# Altium schematic sheet display.SchDoc
size A3
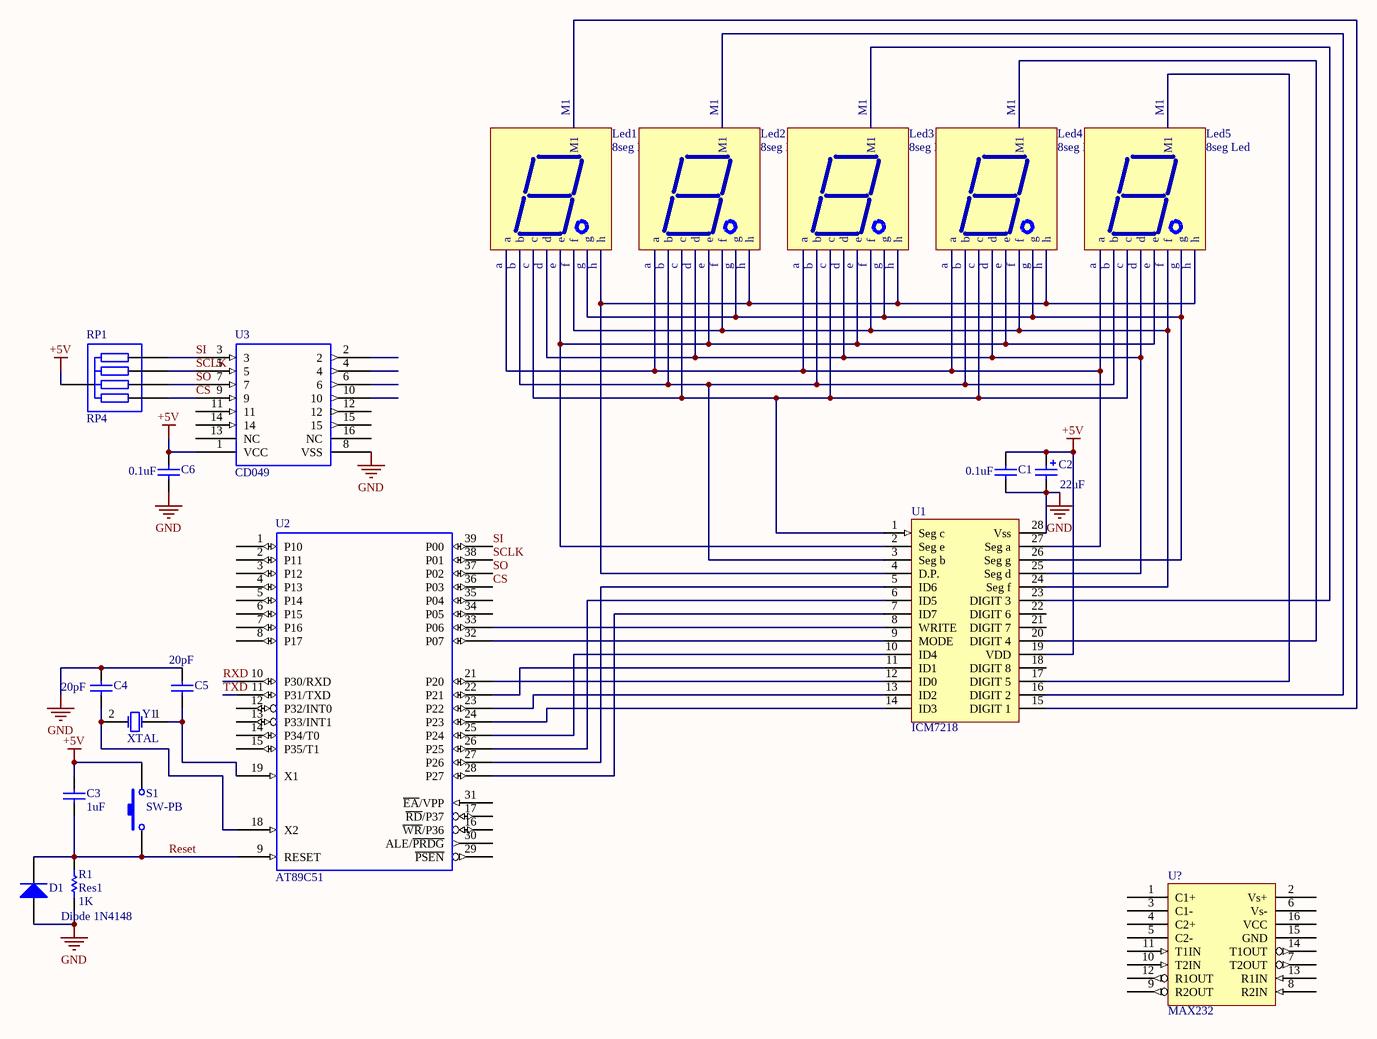
[diagram p0: display.SchDoc]

## Parts
C1  value 0.1uF  [RAD-0.3]  (hidden comment: Cap)
C2  22uF  [POLAR0.8]
C3  value 1uF  [RAD-0.3]  (hidden comment: Cap)
C4  value 20pF  [RAD-0.3]  (hidden comment: Cap)
C5  value 20pF  [RAD-0.3]  (hidden comment: Cap)
C6  value 0.1uF  [RAD-0.3]  (hidden comment: Cap)
D1  Diode 1N4148  [DIO7.1-3.9x1.9]
Led1  8seg Led
Led2  8seg Led
Led3  8seg Led
Led4  8seg Led
Led5  8seg Led
R1  Res1  value 1K  [AXIAL-0.3]
RP1  RP4  [SIP9]
S1  SW-PB  [SPST-2]
U1  ICM7218
U2  AT89C51  [DIP-40]
U3  CD049
U?  MAX232  [SOIC16]
Y1  XTAL  [BCY-W2/D3.1]

## Nets
+5V: C1.2 C2.1 C3.1 C6.2 RP1.1 S1.2 U1.19(VDD) U3.1(VCC)
GND: C1.1 C2.2 C4.1 C5.2 C6.1 D1.1(A) R1.1 U1.28(Vss) U2.20(GND) U3.8(VSS)
VCC: U2.40(VCC)
CS: RP1.5 U2.36(P03) U3.9
Reset: C3.2 D1.2(K) R1.2 S1.1 U2.9(RESET)
RXD: U2.10(P30/RXD)
SCLK: RP1.3 U2.38(P01) U3.5
SI: RP1.2 U2.39(P00) U3.3
SO: RP1.4 U2.37(P02) U3.7
TXD: U2.11(P31/TXD)
NetC4_2: C4.2 U2.18(X2) Y1.2(OSC2)
NetC5_1: C5.1 U2.19(X1) Y1.1(OSC1)
NetLed1_a: Led1.a Led2.a Led3.a Led4.a Led5.a U1.27(Seg_a)
NetLed1_b: Led1.b Led2.b Led3.b Led4.b Led5.b U1.3(Seg_b)
NetLed1_c: Led1.c Led2.c Led3.c Led4.c Led5.c U1.1(Seg_c)
NetLed1_d: Led1.d Led2.d Led3.d Led4.d Led5.d U1.25(Seg_d)
NetLed1_e: Led1.e Led2.e Led3.e Led4.e Led5.e U1.2(Seg_e)
NetLed1_f: Led1.f Led2.f Led3.f Led4.f Led5.f U1.24(Seg_f)
NetLed1_g: Led1.g Led2.g Led3.g Led4.g Led5.g U1.26(Seg_g)
NetLed1_h: Led1.h Led2.h Led3.h Led4.h Led5.h U1.4(D.P.)
NetLed1_M1: Led1.M1 U1.15(DIGIT_1)
NetLed2_M1: Led2.M1 U1.16(DIGIT_2)
NetLed3_M1: Led3.M1 U1.23(DIGIT_3)
NetLed4_M1: Led4.M1 U1.20(DIGIT_4)
NetLed5_M1: Led5.M1 U1.17(DIGIT_5)
NetU1_5: U1.5(ID6) U2.27(P26)
NetU1_6: U1.6(ID5) U2.26(P25)
NetU1_7: U1.7(ID7) U2.28(P27)
NetU1_8: U1.8(WRITE) U2.33(P06)
NetU1_9: U1.9(MODE) U2.32(P07)
NetU1_10: U1.10(ID4) U2.25(P24)
NetU1_11: U1.11(ID1) U2.22(P21)
NetU1_12: U1.12(ID0) U2.21(P20)
NetU1_13: U1.13(ID2) U2.23(P22)
NetU1_14: U1.14(ID3) U2.24(P23)

Not connected (* = marked no-connect by the designer): U1 18(DIGIT_8) 21(DIGIT_7) 22(DIGIT_6); U2 1(P10) 2(P11) 3(P12) 4(P13) 5(P14) 6(P15) 7(P16) 8(P17) 12(P32/INT0) 13(P33/INT1) 14(P34/T0) 15(P35/T1) 16(~{WR}/P36) 17(~{RD}/P37) 29(~{PSEN}) 30(ALE/~{PRDG}) 31(~{EA}/VPP) 34(P05) 35(P04); U3 2 4 6 10 11 12 13(NC) 14 15 16(NC); U? 1(C1+) 2(Vs+) 3(C1-) 4(C2+) 5(C2-) 6(Vs-) 7(T2OUT) 8(R2IN) 9(R2OUT) 10(T2IN) 11(T1IN) 12(R1OUT) 13(R1IN) 14(T1OUT) 15(GND) 16(VCC)

## Library data of the parts
C1 C3-C6 = Cap: Capacitor; Published: 8-Jun-2000; LatestRevisionDate: 17-Jul-2002; LatestRevisionNote: Re-released for DXP Platform.; PackageReference: RAD-0.3; Publisher: Altium Limited
C2 = Cap Pol2: Polarized Capacitor (Axial); Published: 8-Jun-2000; LatestRevisionDate: 17-Jul-2002; LatestRevisionNote: Re-released for DXP Platform.; PackageReference: POLAR0.8; Publisher: Altium Limited; Value: 22uF
D1 = Diode 1N4148: High Conductance Fast Diode; Published: 8-Jun-2000; LatestRevisionDate: 17-Jul-2002; LatestRevisionNote: Re-released for DXP Platform.; DatasheetVersion: 1997; PackageReference: DO-35; Publisher: Altium Limited; Code_JEDEC: DO-204-AH; ComponentLink1Description: Manufacturer Link; ComponentLink1URL: http://www.fairchildsemi.com/; ComponentLink2Description: Datasheet; ComponentLink2URL: http://www.fairchildsemi.com/ds/1N%2F1N4148.pdf
R1 = Res1: Resistor; Published: 8-Jun-2000; LatestRevisionDate: 17-Jul-2002; LatestRevisionNote: Re-released for DXP Platform.; PackageReference: AXIAL-0.3; Publisher: Altium Limited
S1 = SW-PB: Switch; Published: 24-Mar-1999; LatestRevisionDate: 17-Jul-2002; LatestRevisionNote: Re-released for DXP Platform.; PackageReference: SPST-2; Publisher: Altium Limited
U3 = cd4049
U? = MAX232: DUAL EIA-232 DRIVER/RECEIVER
Y1 = XTAL: Crystal Oscillator; Published: 8-Jun-2000; LatestRevisionDate: 17-Jul-2002; LatestRevisionNote: Re-released for DXP Platform.; PackageReference: R38; Publisher: Altium Limited